# Altium schematic sheet driver.SchDoc
size A4; SheetNumber: 3; SheetTotal: 5
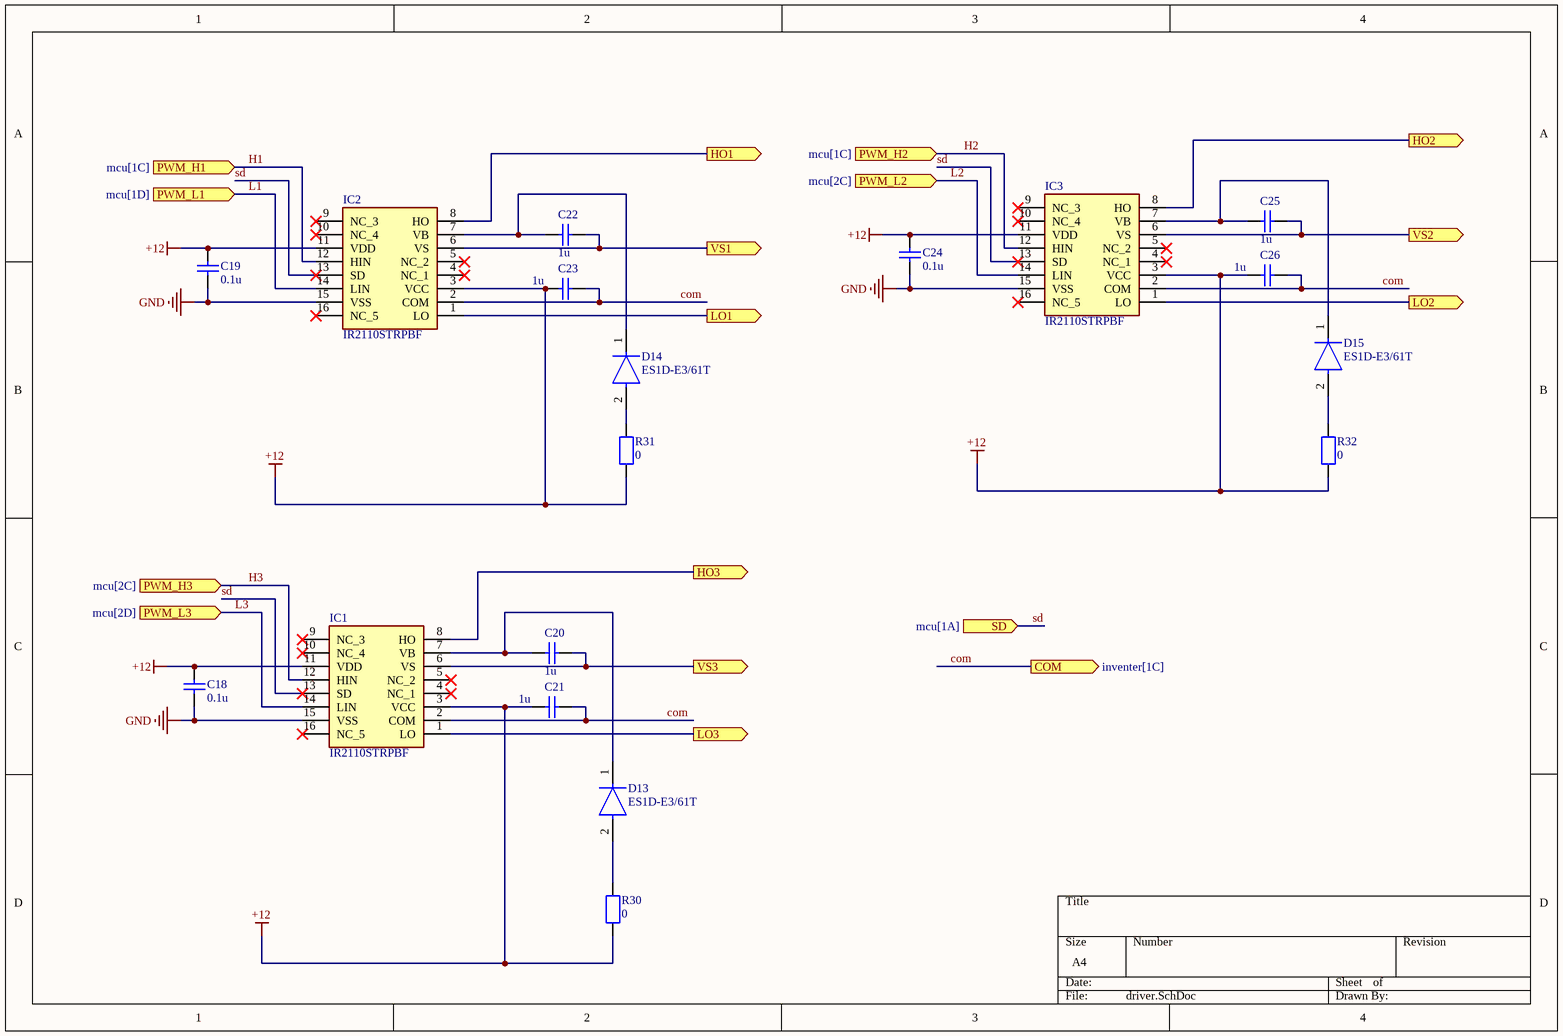
[diagram p0: driver.SchDoc]

## Parts
C18  value 0.1u  [CAPC2012X06N]  (hidden comment: CAP)
C19  value 0.1u  [CAPC2012X06N]  (hidden comment: CAP)
C20  value 1u  [CAPC2012X06N]  (hidden comment: CAP)
C21  value 1u  [CAPC2012X06N]  (hidden comment: CAP)
C22  value 1u  [CAPC2012X06N]  (hidden comment: CAP)
C23  value 1u  [CAPC2012X06N]  (hidden comment: CAP)
C24  value 0.1u  [CAPC2012X06N]  (hidden comment: CAP)
C25  value 1u  [CAPC2012X06N]  (hidden comment: CAP)
C26  value 1u  [CAPC2012X06N]  (hidden comment: CAP)
D13  ES1D-E3/61T  [FP-95400-MFG]
D14  ES1D-E3/61T  [FP-95400-MFG]
D15  ES1D-E3/61T  [FP-95400-MFG]
IC1  IR2110STRPBF  [SOIC127P1032X265-16N]
IC2  IR2110STRPBF  [SOIC127P1032X265-16N]
IC3  IR2110STRPBF  [SOIC127P1032X265-16N]
R30  value 0  [RESC3016X06N]  (hidden comment: Resistor)
R31  value 0  [RESC3016X06N]  (hidden comment: Resistor)
R32  value 0  [RESC3016X06N]  (hidden comment: Resistor)

## Ports
COM (out, see inventer[1C]), HO1 (out, see inventer[1A]), HO2 (out, see inventer[2A]), HO3 (out, see inventer[3A]), LO1 (out, see inventer[1B]), LO2 (out, see inventer[2B]), LO3 (out, see inventer[3B]), PWM_H1 (in, see mcu[1C]), PWM_H2 (in, see mcu[1C]), PWM_H3 (in, see mcu[2C]), PWM_L1 (in, see mcu[1D]), PWM_L2 (in, see mcu[2C]), PWM_L3 (in, see mcu[2D]), SD (in, see mcu[1A]), VS1 (out, see inventer[1B]), VS2 (out, see inventer[2B]), VS3 (out, see inventer[3B])

## Nets
+12: C18.1 C19.1 C21.2 C23.2 C24.1 C26.2 IC1.3(VCC) IC1.11(VDD) IC2.3(VCC) IC2.11(VDD) IC3.3(VCC) IC3.11(VDD) R30.1 R31.1 R32.1
GND: C18.2 C19.2 C24.2 IC1.15(VSS) IC2.15(VSS) IC3.15(VSS)
com: C21.1 C23.1 C26.1 IC1.2(COM) IC2.2(COM) IC3.2(COM) ; port COM
H1: IC2.12(HIN) ; port PWM_H1
H2: IC3.12(HIN) ; port PWM_H2
H3: IC1.12(HIN) ; port PWM_H3
HO1: IC2.8(HO) ; port HO1
HO2: IC3.8(HO) ; port HO2
HO3: IC1.8(HO) ; port HO3
L1: IC2.14(LIN) ; port PWM_L1
L2: IC3.14(LIN) ; port PWM_L2
L3: IC1.14(LIN) ; port PWM_L3
LO1: IC2.1(LO) ; port LO1
LO2: IC3.1(LO) ; port LO2
LO3: IC1.1(LO) ; port LO3
sd: IC1.13(SD) IC2.13(SD) IC3.13(SD) ; port SD
VS1: C22.2 IC2.6(VS) ; port VS1
VS2: C25.2 IC3.6(VS) ; port VS2
VS3: C20.2 IC1.6(VS) ; port VS3
NetC20_1: C20.1 D13.1(C) IC1.7(VB)
NetC22_1: C22.1 D14.1(C) IC2.7(VB)
NetC25_1: C25.1 D15.1(C) IC3.7(VB)
NetD13_2: D13.2(A) R30.2
NetD14_2: D14.2(A) R31.2
NetD15_2: D15.2(A) R32.2

Not connected (* = marked no-connect by the designer): IC1 4(NC_1)* 5(NC_2)* 9(NC_3)* 10(NC_4)* 16(NC_5)*; IC2 4(NC_1)* 5(NC_2)* 9(NC_3)* 10(NC_4)* 16(NC_5)*; IC3 4(NC_1)* 5(NC_2)* 9(NC_3)* 10(NC_4)* 16(NC_5)*

## Library data of the parts
C18 C19 C24 = CAP: Конденсатор керамический smd 0.01 мкФ NPO 50В 5%; Source: *
C20-C23 C25 C26 = CAP: Конденсатор керамический smd 1 мкФ X7R 10% 50В 0805; Source: *
D13-D15 = CMP-02540-000037-1: DIODE GEN PURP 200V 1A DO214AC; Manufacturer: Vishay; Standoff Height: 0mm; Peak Reverse Current: 5uA; Value: 10 pF; Max Surge Forward Current: 30A; Max Junction Temp: +150°C; Device Class L3: Rectifier Diodes; RoHS: TRUE; Device Class L1: Discrete Semiconductors; Lead Free: Yes; ComponentLink2Description: Datasheet; Digikey Description: DIODE GEN PURP 200V 1A DO214AC; Device Class L2: Diodes; Package: 95400; Max Repetitive Reverse Voltage: 200V; Footprint Url: http://www.vishay.com/docs/95400/sma.pdf; Temperature Range High: +150°C; ComponentLink2URL: http://www.vishay.com/docs/88586/es1.pdf; Automotive: No; Octopart: https://octopart.com/es1d-e3%2F61t-vishay-39550266; Manufacturer Part Number: ES1D-E3/61T; Temperature: -55°C to +150°C; Category: Diode; Temperature Range Low: -55°C; Height: 2.29mm; Capacitance: 10 pF; Mouser Description: Ultrafast Rectifier, Plastic Surface Mount, 1 A, 200 VDC, DO0214AC (SMA), RoHS; Forward Current: 1A
IC1-IC3 = IR2110STRPBF: IR2110STRPBF, Полумостовой драйвер HIGH/LOW SIDE; Manufacturer_Name: Infineon; Datasheet Link: https://www.infineon.com/cms/en/product/power/gate-driver-ics/?; Height: 2.65mm; Manufacturer_Part_Number: IR2110STRPBF; Mouser Part Number: 942-IR2110STRPBF; Mouser Price/Stock: https://www.mouser.co.uk/ProductDetail/Infineon-Technologies/IR2110STRPBF?qs=2r01AXMCG3P4pNuJUqFzxg%3D%3D; Arrow Part Number: IR2110STRPBF; Arrow Price/Stock: https://www.arrow.com/en/products/ir2110strpbf/infineon-technologies-ag?region=nac
R30-R32 = Resistor: Source: *